# EAGLE design motorboardsurface (EAGLE 7.1.0)
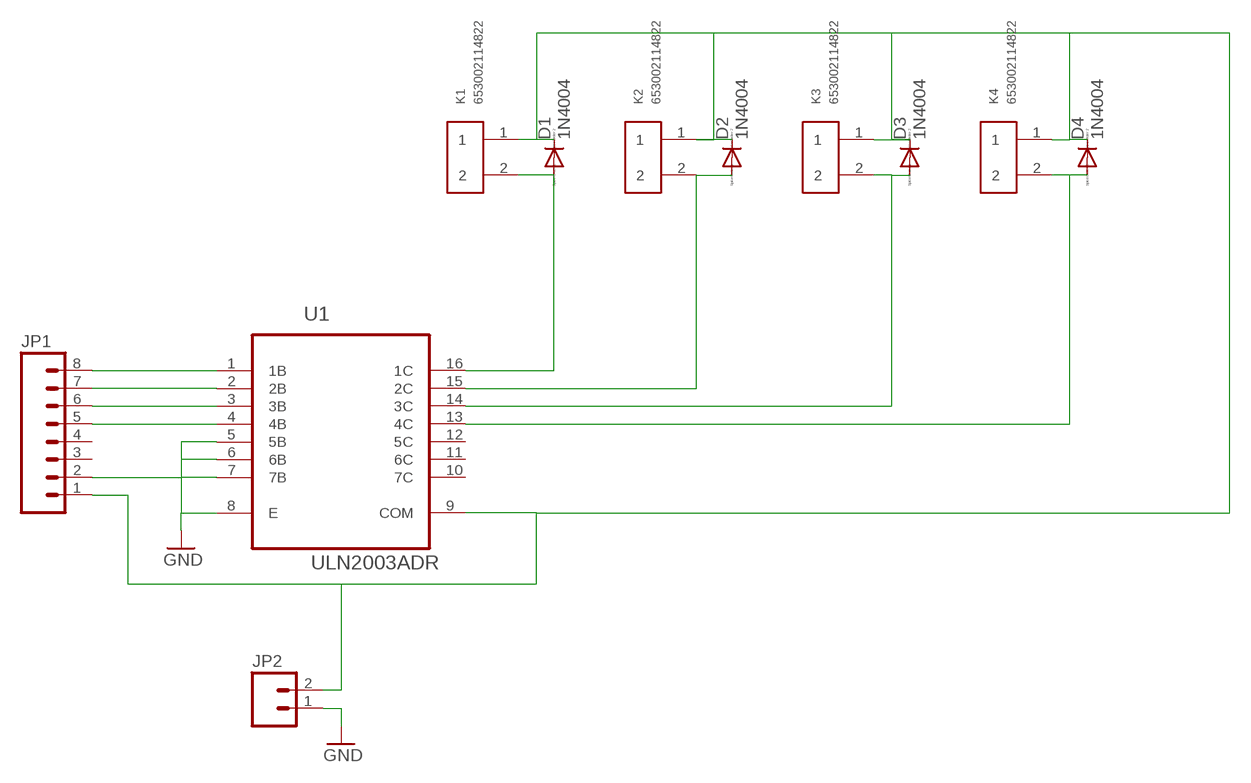
[diagram p0: schematic, sheet 1]

## Parts
D1  1N4004  [DO41-10]
D2  1N4004  [DO41-10]
D3  1N4004  [DO41-10]
D4  1N4004  [DO41-10]
JP1  M08NO_SILK_FEMALE_PTH  [1X08_NO_SILK]
JP2  M02LOCK_LONGPADS  [1X02_LOCK_LONGPADS]
K1  653002114822  [653002114822]
K2  653002114822  [653002114822]
K3  653002114822  [653002114822]
K4  653002114822  [653002114822]
U1  ULN2003ADR  [SOIC127P600X175-16N]

## Nets
GND: JP1.2 JP2.1 U1.5(5B) U1.6(6B) U1.7(7B) U1.8(E)
N$1: D1.C D2.C D3.C D4.C JP1.1 JP2.2 K1.1 K2.1 K3.1 K4.1 U1.9(COM)
N$3: JP1.8 U1.1(1B)
N$4: JP1.7 U1.2(2B)
N$5: JP1.6 U1.3(3B)
N$6: JP1.5 U1.4(4B)
N$7: D1.A K1.2 U1.16(1C)
N$8: D2.A K2.2 U1.15(2C)
N$9: D3.A K3.2 U1.14(3C)
N$10: D4.A K4.2 U1.13(4C)
Unconnected: JP1.3 JP1.4 U1.10(7C) U1.11(6C) U1.12(5C)

## Library data of the parts
D1-D4 = diode:1N4004: DIODE general purpose rectifier, 1 A; MF: NTE ELECTRONICS; MPN: 1N4004; OC_FARNELL: 2295710
JP1 = SparkFun-Connectors:M08: Header 8 Standard 8-pin 0.1" header. Use with straight break away headers (SKU : PRT-00116), right angle break away headers (PRT-00553), swiss pins (PRT-00743), machine pins (PRT-00117), and female headers (PRT-00115).; OC_FARNELL: unknown; PROD_ID: CONN-08438
JP2 = SparkFun-Connectors:M02: Standard 2-pin 0.1" header. Use with - straight break away headers ( PRT-00116) - right angle break away headers (PRT-00553) - swiss pins (PRT-00743) - machine pins (PRT-00117) - female headers (PRT-00115) Molex polarized connector foot print use with: PRT-08233 with associated crimp pins and housings. 2.54_SCREWTERM for use with PRT-10571. 3.5mm Screw Terminal footprints for PRT-08084 5mm Screw Terminal footprints for use with PRT-08432
K1-K4 = Wuerth_Elektronik_eiCan_Wire_to_Board_Connectors:653002114822: WR-WTB 1.25mm Male Vertical Shrouded Header, 2 Pins=>Code : Con_WTB_1.25_PCB_THT_653002114822 <http://katalog.we-online.de/media/thumbs2/eican/thb_Con_WTB_1.25_PCB_THT_6530xx114822_pf2.jpg> Details see: http://katalog.we-online.de/en/em/653_0xx_114_822 Created 2014-06-06, Karrer Zheng 2014 (C) Würth Elektronik; OC_FARNELL: unknown
U1 = Texas Instruments_By_element14_Batch_1:ULN2003ADR: 8-BIT SHIFT REGISTERS WITH 3-STATE OUTPUT REGISTERS; MPN: ULN2003ADR; OC_FARNELL: 1470513; OC_NEWARK: 77C3560; PACKAGE: SOIC-16; SUPPLIER: TEXAS INSTRUMENTS

## Board
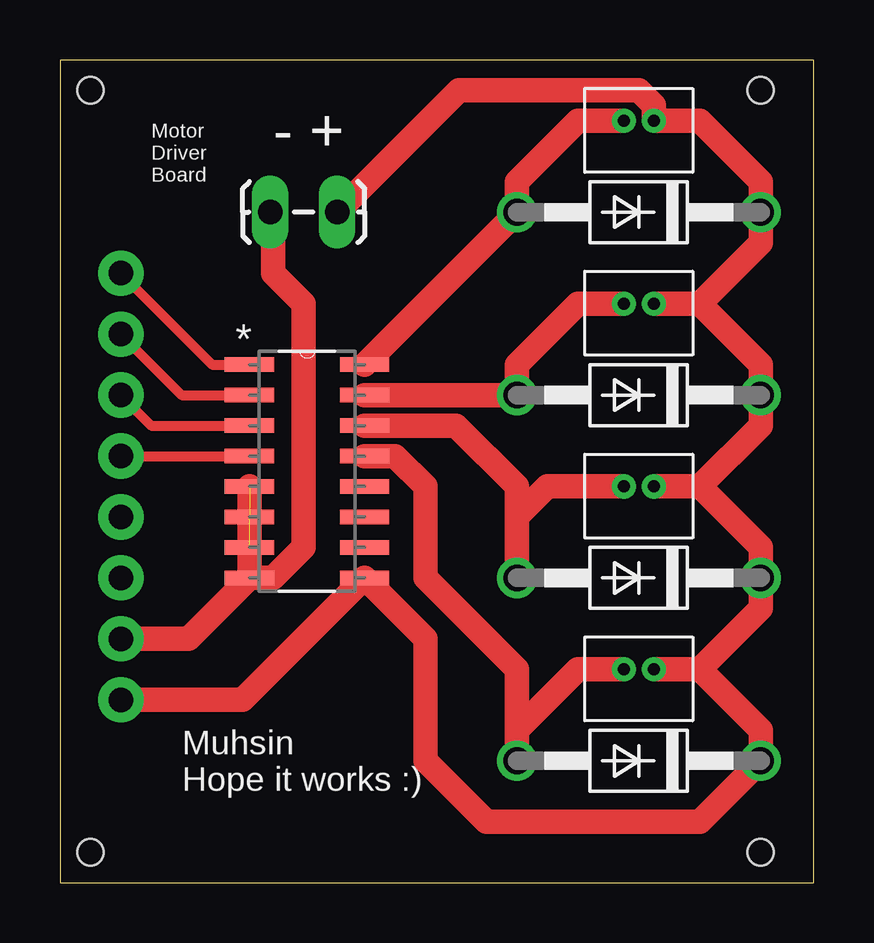
[diagram p1: board, top side]

Size 31.42 x 34.28 mm. Coordinates in mm from the lower left corner, seen from the top.
Outline: 0,0 31.42,0 31.42,34.28 0,34.28 0,0
Copper layers (1*16): Top 0.035559375mm / dielectric 1.501140625mm / Bottom 0.035559375mm
Design rules "4pcb-33board": minimum track width 10mil, minimum drill 15mil, track to track 6mil, track to pad 6mil, pad to pad 6mil, via to via 6mil, smd to smd 6mil, copper to edge 10mil, drill to drill 10mil, minimum pad ring 10mil, minimum via ring 8mil, stop-mask expansion 4mil, vias tented up to drill 0mil, thermal gap 10mil
Holes 1.1 mm at 1.27,1.27 29.21,1.27 1.27,33.02 29.21,33.02

### Footprints (pad centres in the part's own frame; a part is rotated, then mirrored left to right if it is on the bottom)
DO41-10 = drill 1.118: A 5.08,0; C -5.08,0
1X08_NO_SILK = drill 1.016 pad 1.88: 1 0,0; 2 2.54,0; 3 5.08,0; 4 7.62,0; 5 10.16,0; 6 12.7,0; 7 15.24,0; 8 17.78,0
1X02_LOCK_LONGPADS = drill 1.016 long: 1 -0.127,0; 2 2.667,0
653002114822 = drill 0.5: 1 0.625,0; 2 -0.625,0
SOIC127P600X175-16N = smd 2.057 x 0.61: 1 -4.801,8.89; 2 -4.801,7.62; 3 -4.801,6.35; 4 -4.801,5.08; 5 -4.801,3.81; 6 -4.801,2.54; 7 -4.801,1.27; 8 -4.801,0; 9 0,0; 10 0,1.27; 11 0,2.54; 12 0,3.81; 13 0,5.08; 14 0,6.35; 15 0,7.62; 16 0,8.89

### Placement (x,y rotation side)
D1  24.13,27.94 180 top
D2  24.13,20.32 180 top
D3  24.13,12.7 180 top
D4  24.13,5.08 180 top
JP1  2.54,7.62 90 top
JP2  8.89,27.94 0 top
K1  24.13,31.75 0 top
K2  24.13,24.13 0 top
K3  24.13,16.51 0 top
K4  24.13,8.89 0 top
U1  12.7,12.7 0 top

### Tracks (layer width: path | path; a pad name or v marks a point on that pad's centre or on a via)
GND  (2 unrouted)
  Top 1.016: JP1.2 5.36,10.16 U1.8 | U1.8 U1.5 | U1.8 8.89,12.7 10.16,13.97 10.16,24.13 8.89,25.4 8.89,27.81 JP2.1
N$1
  Top 1.016: JP1.1 7.62,7.62 U1.9 15.24,10.16 15.24,5.08 17.78,2.54 26.67,2.54 D4.C 29.21,6.35 26.67,8.89 | K4.1 26.67,8.89 | 26.67,8.89 29.21,11.43 D3.C 29.21,13.97 26.67,16.51 | K3.1 26.67,16.51 | 26.67,16.51 29.21,19.05 D2.C 29.21,21.59 26.67,24.13 | K2.1 26.67,24.13 | 26.67,24.13 29.21,26.67 D1.C 29.21,29.21 26.67,31.75 K1.1 24.75,32.4 24.13,33.02 16.64,33.02 JP2.2
N$3
  Top 0.406: JP1.8 6.35,21.59 U1.1
N$4
  Top 0.406: JP1.7 5.08,20.32 U1.2
N$5
  Top 0.406: JP1.6 3.81,19.05 U1.3
N$6
  Top 0.406: JP1.5 U1.4
N$7
  Top 1.016: K1.2 21.59,31.75 19.05,29.21 D1.A U1.16
N$8
  Top 1.016: U1.15 D2.A 19.05,21.59 21.59,24.13 K2.2
N$9
  Top 1.016: U1.14 16.51,19.05 19.05,16.51 D3.A 19.05,15.24 20.32,16.51 K3.2
N$10
  Top 1.016: K4.2 21.59,8.89 19.05,6.35 D4.A 19.05,8.89 15.24,12.7 15.24,16.51 13.97,17.78 U1.13

### Text on the board
tPlace: - + | Motor / Driver / Board | Muhsin / Hope it works :)